# EAGLE schematic transmiter switch (EAGLE 6.5.0)
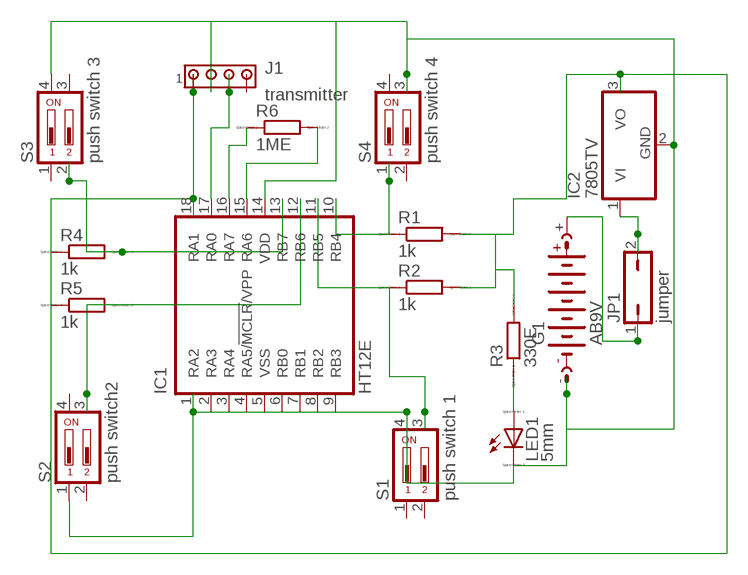
[diagram p0: schematic, sheet 1]

## Parts
G1  AB9V  [AB9V]
IC1  HT12E  PIC16F1826/27P  [DIL18]
IC2  7805TV  [TO220V]
J1  transmitter  MTA04-100  [10X04MTA]
JP1  jumper  JP1Q  [JP1]
LED1  5mm  LED_ELD260  [LED_LD260]
R1  1k  R0204/7  [0204/7]
R2  1k  R0204/7  [0204/7]
R3  330E  R0204/7  [0204/7]
R4  1k  R0204/7  [0204/7]
R5  1k  R0204/7  [0204/7]
R6  1ME  R0204/7  [0204/7]
S1  push switch 1  DS02  [DS-02]
S2  push switch2  DS02  [DS-02]
S3  push switch 3  DS02  [DS-02]
S4  push switch 4  DS02  [DS-02]

## Nets
N$1: LED1.A R3.1
N$2: IC1.10(RB4) R1.1 S4.1
N$3: IC1.11(RB5) R2.1 S1.3
N$4: IC1.12(RB6) R5.2 S2.3
N$5: IC1.13(RB7) R4.2 S3.2
N$6: IC1.16(RA7) R6.1
N$7: IC1.15(RA6) R6.2
N$8: IC1.18(RA1) IC2.3(VO) J1.1 R1.2 R2.2 R3.2 R4.1 R5.1
N$9: IC1.17(RA0) J1.3
N$10: G1.- IC1.1(RA2) IC1.2(RA3) IC1.3(RA4) IC1.4(RA5/!MCLR!/VPP) IC1.5(VSS) IC1.6(RB0) IC1.7(RB1) IC1.8(RB2) IC1.9(RB3) IC1.14(VDD) IC2.2(GND) J1.2 LED1.K(C) S1.4 S2.1 S3.4 S4.3
N$11: G1.+ JP1.1
N$13: IC2.1(VI) JP1.2
Unconnected: J1.4 S1.1 S1.2 S2.2 S2.4 S3.1 S3.3 S4.2 S4.4

## Library data of the parts
G1 = battery:AB9V: 9-V BATTERY CLIP
IC1 = microchip:PIC16*F1826/27: 18/20/28-Pin Flash Microcontrollers with nanoWatt XLP Technology Source: www.microchip.com PIC16F1827.pdf
IC2 = linear:78*: Positive VOLTAGE REGULATOR Source: http://cache.national.com/ds/LM/LM78L05.pdf http://www.fairchildsemi.com/ds/LM/LM7805.pdf
J1 = con-amp:MTA04-100: AMP connector
JP1 = jumper:JP1Q: JUMPER
LED1 = eagle-ltspice:LED_E: LED Source: http://www.osram.convergy.de Source: www.luxeon.com Source: www.kingbright.com; SPICEMODEL: NONE; SPICEPREFIX: D; SPICETYPE: diode
R1-R6 = eagle-ltspice:R: RESISTOR, European symbol; SPICEMODEL: NONE; SPICEPREFIX: R
S1-S4 = switch-dil:DS02: DIL/CODE SWITCH; OC_FARNELL: 9472126; OC_NEWARK: unknown